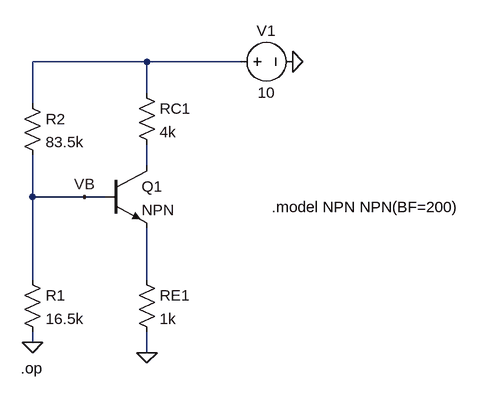
[diagram p0: schematic Lab6_3.asc]
Lab6_3.asc, the LTspice schematic file:
Version 4
SHEET 1 880 680
WIRE 64 -112 -112 -112
WIRE 208 -112 64 -112
WIRE 64 -64 64 -112
WIRE -112 -48 -112 -112
WIRE 64 48 64 16
WIRE -112 96 -112 32
WIRE -32 96 -112 96
WIRE 0 96 -32 96
WIRE -112 224 -112 96
WIRE 64 224 64 144
WIRE -112 320 -112 304
WIRE 64 336 64 304
FLAG 64 336 0
FLAG 288 -112 0
FLAG -112 320 0
FLAG -32 96 VB
SYMBOL res 48 -80 R0
SYMATTR InstName RC1
SYMATTR Value 4k
SYMBOL res 48 208 R0
SYMATTR InstName RE1
SYMATTR Value 1k
SYMBOL voltage 192 -112 R270
WINDOW 0 32 56 VTop 2
WINDOW 3 -32 56 VBottom 2
WINDOW 123 0 0 Left 0
WINDOW 39 0 0 Left 0
SYMATTR InstName V1
SYMATTR Value 10
SYMBOL npn 0 48 R0
SYMATTR InstName Q1
SYMBOL res -128 -64 R0
SYMATTR InstName R2
SYMATTR Value 83.5k
SYMBOL res -128 208 R0
SYMATTR InstName R1
SYMATTR Value 16.5k
TEXT -130 360 Left 2 !.op
TEXT 256 112 Left 2 !.model NPN NPN(BF=200)

The netlist it stands for:
* Lab6_3.asc
RC1 N001 N002 4k
RE1 N003 0 1k
V1 N001 0 10
Q1 N002 VB N003 0 NPN
R2 N001 VB 83.5k
R1 VB 0 16.5k
.model NPN NPN
.model PNP PNP
.lib standard.bjt
.op
.model NPN NPN(BF=200)
.backanno
.end